# EAGLE design Main (EAGLE 9.0.1)
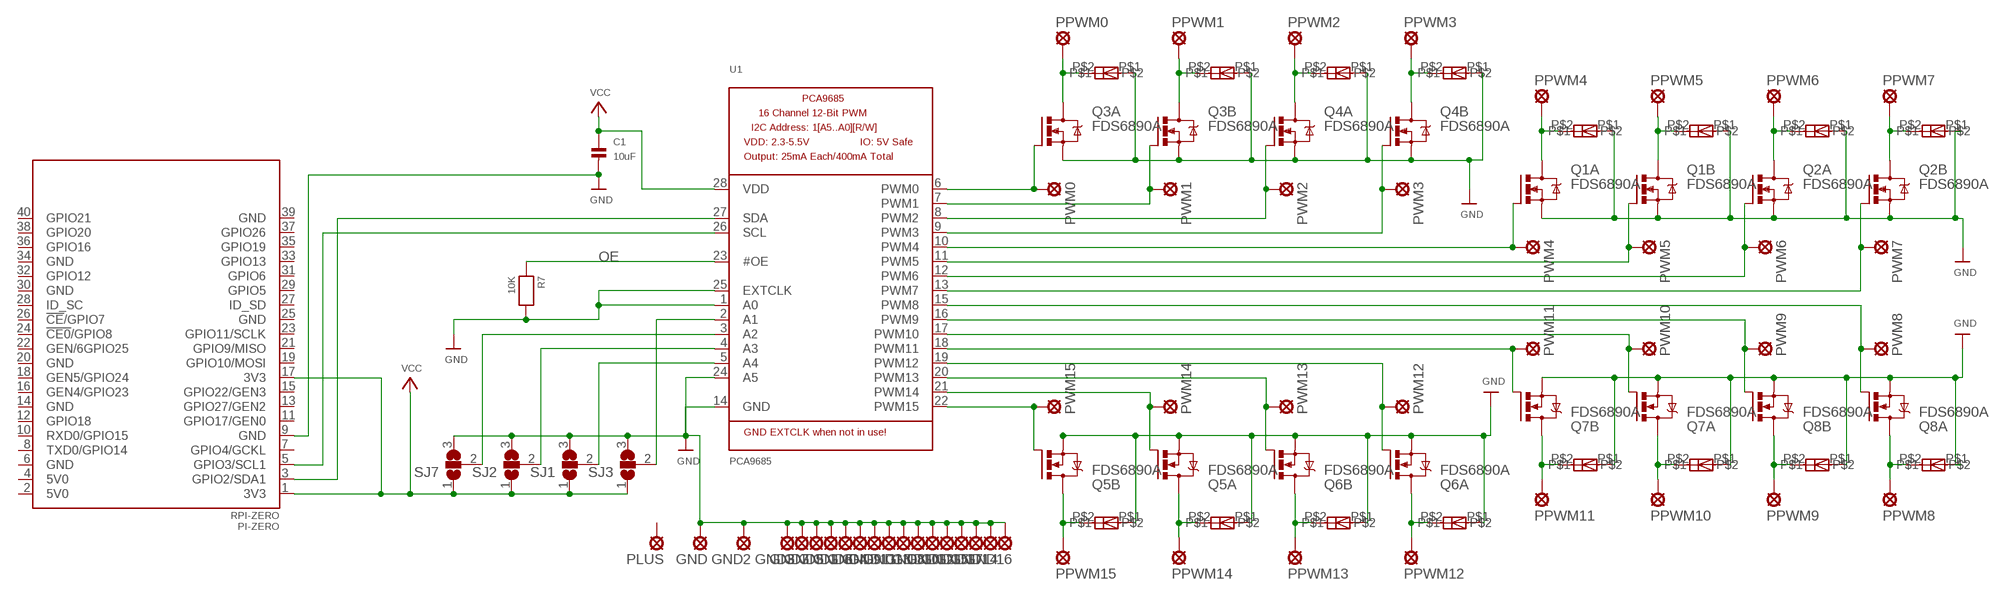
[diagram p0: schematic, sheet 1]

## Parts
C1  10uF  CAP_CERAMIC0805  [0805]
GND  LSP11  [LSP11]
GND1  LSP11  [LSP11]
GND2  LSP11  [LSP11]
GND3  LSP11  [LSP11]
GND4  LSP11  [LSP11]
GND5  LSP11  [LSP11]
GND6  LSP11  [LSP11]
GND7  LSP11  [LSP11]
GND8  LSP11  [LSP11]
GND9  LSP11  [LSP11]
GND10  LSP11  [LSP11]
GND11  LSP11  [LSP11]
GND12  LSP11  [LSP11]
GND13  LSP11  [LSP11]
GND14  LSP11  [LSP11]
GND15  LSP11  [LSP11]
GND16  LSP11  [LSP11]
GND17  LSP11  [LSP11]
PI-ZERO  RPI-ZERO  [RASPBERRYPI_BASTELSTUBE_V13_RASPI_BOARD_B+_FULL]
PLUS  LSP11  [LSP11]
PPWM0  LSP11  [LSP11]
PPWM1  LSP11  [LSP11]
PPWM2  LSP11  [LSP11]
PPWM3  LSP11  [LSP11]
PPWM4  LSP11  [LSP11]
PPWM5  LSP11  [LSP11]
PPWM6  LSP11  [LSP11]
PPWM7  LSP11  [LSP11]
PPWM8  LSP11  [LSP11]
PPWM9  LSP11  [LSP11]
PPWM10  LSP11  [LSP11]
PPWM11  LSP11  [LSP11]
PPWM12  LSP11  [LSP11]
PPWM13  LSP11  [LSP11]
PPWM14  LSP11  [LSP11]
PPWM15  LSP11  [LSP11]
PWM0  LSP11  [LSP11]
PWM1  LSP11  [LSP11]
PWM2  LSP11  [LSP11]
PWM3  LSP11  [LSP11]
PWM4  LSP11  [LSP11]
PWM5  LSP11  [LSP11]
PWM6  LSP11  [LSP11]
PWM7  LSP11  [LSP11]
PWM8  LSP11  [LSP11]
PWM9  LSP11  [LSP11]
PWM10  LSP11  [LSP11]
PWM11  LSP11  [LSP11]
PWM12  LSP11  [LSP11]
PWM13  LSP11  [LSP11]
PWM14  LSP11  [LSP11]
PWM15  LSP11  [LSP11]
Q1  FDS6890A  [M08A]
Q2  FDS6890A  [M08A]
Q3  FDS6890A  [M08A]
Q4  FDS6890A  [M08A]
Q5  FDS6890A  [M08A]
Q6  FDS6890A  [M08A]
Q7  FDS6890A  [M08A]
Q8  FDS6890A  [M08A]
R7  10K  RESISTOR0805  [0805]
SJ1  SJ2W  [SJ_2]
SJ2  SJ2W  [SJ_2]
SJ3  SJ2W  [SJ_2]
SJ7  SJ2W  [SJ_2]
U1  PCA9685  MICROBUILDER_PCA9685  [MICROBUILDER_TSSOP28]
U$6  OPTIONALDIODE  [OPTIONALDIODE]
U$7  OPTIONALDIODE  [OPTIONALDIODE]
U$8  OPTIONALDIODE  [OPTIONALDIODE]
U$9  OPTIONALDIODE  [OPTIONALDIODE]
U$10  OPTIONALDIODE  [OPTIONALDIODE]
U$11  OPTIONALDIODE  [OPTIONALDIODE]
U$12  OPTIONALDIODE  [OPTIONALDIODE]
U$13  OPTIONALDIODE  [OPTIONALDIODE]
U$14  OPTIONALDIODE  [OPTIONALDIODE]
U$15  OPTIONALDIODE  [OPTIONALDIODE]
U$16  OPTIONALDIODE  [OPTIONALDIODE]
U$17  OPTIONALDIODE  [OPTIONALDIODE]
U$18  OPTIONALDIODE  [OPTIONALDIODE]
U$19  OPTIONALDIODE  [OPTIONALDIODE]
U$20  OPTIONALDIODE  [OPTIONALDIODE]
U$21  OPTIONALDIODE  [OPTIONALDIODE]

## Nets
GND: C1.2 GND1.MP GND2.MP GND3.MP GND4.MP GND5.MP GND6.MP GND7.MP GND8.MP GND9.MP GND10.MP GND11.MP GND12.MP GND13.MP GND14.MP GND15.MP GND16.MP GND17.MP GND.MP PI-ZERO.9(GND) Q1.1(A:S) Q1.3(B:S) Q2.1(A:S) Q2.3(B:S) Q3.1(A:S) Q3.3(B:S) Q4.1(A:S) Q4.3(B:S) Q5.1(A:S) Q5.3(B:S) Q6.1(A:S) Q6.3(B:S) Q7.1(A:S) Q7.3(B:S) Q8.1(A:S) Q8.3(B:S) R7.2 SJ1.3 SJ2.3 SJ3.3 SJ7.3 U1.1(A0) U1.14(GND) U1.24(A5) U1.25(EXTCLK) U$6.P$1 U$7.P$1 U$8.P$1 U$9.P$1 U$10.P$1 U$11.P$1 U$12.P$1 U$13.P$1 U$14.P$1 U$15.P$1 U$16.P$1 U$17.P$1 U$18.P$1 U$19.P$1 U$20.P$1 U$21.P$1
LPWM0: PWM0.MP Q3.2(A:G) U1.6(PWM0)
LPWM1: PWM1.MP Q3.4(B:G) U1.7(PWM1)
LPWM2: PWM2.MP Q4.2(A:G) U1.8(PWM2)
LPWM3: PWM3.MP Q4.4(B:G) U1.9(PWM3)
LPWM4: PWM4.MP Q1.2(A:G) U1.10(PWM4)
LPWM5: PWM5.MP Q1.4(B:G) U1.11(PWM5)
LPWM6: PWM6.MP Q2.2(A:G) U1.12(PWM6)
LPWM7: PWM7.MP Q2.4(B:G) U1.13(PWM7)
LPWM8: PWM8.MP Q8.2(A:G) U1.15(PWM8)
LPWM9: PWM9.MP Q8.4(B:G) U1.16(PWM9)
LPWM10: PWM10.MP Q7.2(A:G) U1.17(PWM10)
LPWM11: PWM11.MP Q7.4(B:G) U1.18(PWM11)
LPWM12: PWM12.MP Q6.2(A:G) U1.19(PWM12)
LPWM13: PWM13.MP Q6.4(B:G) U1.20(PWM13)
LPWM14: PWM14.MP Q5.2(A:G) U1.21(PWM14)
LPWM15: PWM15.MP Q5.4(B:G) U1.22(PWM15)
N$1: PPWM0.MP Q3.7(A:D) Q3.8(A:D) U$7.P$2
N$2: PPWM1.MP Q3.5(B:D) Q3.6(B:D) U$8.P$2
N$3: PPWM2.MP Q4.7(A:D) Q4.8(A:D) U$9.P$2
N$4: PPWM3.MP Q4.5(B:D) Q4.6(B:D) U$10.P$2
N$6: PPWM4.MP Q1.7(A:D) Q1.8(A:D) U$11.P$2
N$7: PPWM5.MP Q1.5(B:D) Q1.6(B:D) U$12.P$2
N$8: PPWM6.MP Q2.7(A:D) Q2.8(A:D) U$13.P$2
N$9: PPWM7.MP Q2.5(B:D) Q2.6(B:D) U$14.P$2
N$11: PPWM15.MP Q5.5(B:D) Q5.6(B:D) U$6.P$2
N$12: PPWM14.MP Q5.7(A:D) Q5.8(A:D) U$21.P$2
N$13: PPWM13.MP Q6.5(B:D) Q6.6(B:D) U$20.P$2
N$14: PPWM12.MP Q6.7(A:D) Q6.8(A:D) U$19.P$2
N$16: PPWM11.MP Q7.5(B:D) Q7.6(B:D) U$18.P$2
N$17: PPWM10.MP Q7.7(A:D) Q7.8(A:D) U$17.P$2
N$18: PPWM9.MP Q8.5(B:D) Q8.6(B:D) U$16.P$2
N$19: PPWM8.MP Q8.7(A:D) Q8.8(A:D) U$15.P$2
N$21: PI-ZERO.5(GPIO3/SCL1) U1.26(SCL)
N$22: SJ7.2 U1.3(A2)
N$23: SJ2.2 U1.4(A3)
N$24: SJ1.2 U1.5(A4)
N$26: PI-ZERO.3(GPIO2/SDA1) U1.27(SDA)
N$27: SJ3.2 U1.2(A1)
OE: R7.1 U1.23(#OE)
VCC: C1.1 PI-ZERO.1(3V3) PI-ZERO.17(3V3) SJ1.1 SJ2.1 SJ3.1 SJ7.1 U1.28(VDD)
Unconnected: PI-ZERO.2(5V0) PI-ZERO.4(5V0) PI-ZERO.6(GND) PI-ZERO.7(GPIO4/GCKL) PI-ZERO.8(TXD0/GPIO14) PI-ZERO.10(RXD0/GPIO15) PI-ZERO.11(GPIO17/GEN0) PI-ZERO.12(GPIO18) PI-ZERO.13(GPIO27/GEN2) PI-ZERO.14(GND) PI-ZERO.15(GPIO22/GEN3) PI-ZERO.16(GEN4/GPIO23) PI-ZERO.18(GEN5/GPIO24) PI-ZERO.19(GPIO10/MOSI) PI-ZERO.20(GND) PI-ZERO.21(GPIO9/MISO) PI-ZERO.22(GEN/6GPIO25) PI-ZERO.23(GPIO11/SCLK) PI-ZERO.24(!CE0!/GPIO8) PI-ZERO.25(GND) PI-ZERO.26(!CE!/GPIO7) PI-ZERO.27(ID_SD) PI-ZERO.28(ID_SC) PI-ZERO.29(GPIO5) PI-ZERO.30(GND) PI-ZERO.31(GPIO6) PI-ZERO.32(GPIO12) PI-ZERO.33(GPIO13) PI-ZERO.34(GND) PI-ZERO.35(GPIO19) PI-ZERO.36(GPIO16) PI-ZERO.37(GPIO26) PI-ZERO.38(GPIO20) PI-ZERO.39(GND) PI-ZERO.40(GPIO21) PLUS.MP

## Library data of the parts
C1 = microbuilder:CAP_CERAMIC: Ceramic Capacitors 0402 - 0402 Surface Mount Capacitors 16pF 50V 5% [Digikey: 445-4899-2-ND] 18pF 50V 5% [Digikey: 490-1281-2-ND] 22pF 50V 5% [Digikey: 490-1283-2-ND] 68pF 50V 5% [Digikey: 490-1289-2-ND] 0.1uF 10V 10% [Digikey: 490-1318-2-ND] 1.0uF 6.3V 10% [Digikey: 490-1320-2-ND] 0603 - 0603 Surface Mount Capacitors 16 pF 50V 5% [Digikey: 445-5051-2-ND] 22 pF 50V [Digikey: PCC220ACVTR-ND] 33 pF 50V 5% [Digikey: 490-1415-1-ND] 56pF 50V 5% [Digikey: 490-1421-1-ND] 220pF 50V 5% [Digikey: 445-1285-1-ND] 680 pF 50V 2200 pF 50V 5% C0G [Digikey: 445-1297-1-ND] 5600 pF 100V 5% X7R [Digikey: 478-3711-1-ND] 0.1 µF 25V 10% [Digikey: PCC2277TR-ND] 0.22 µF 16V 10% X7R [Digikey: 445-1318-1-ND] 1.0 µF 25V 10% [Digikey: 445-5146-2-ND] 0603 - RF Specific 3pF 250V +/-0.1pF RF [Digikey: 712-1347-1-ND] 18 pF 250V 5% [Digikey: 478-3505-1-ND or 712-1322-1-ND] 56 pF 250V 5% C0G RF [Digikey: 490-4867-1-ND] 68 pF 250V RF [Digikey: 490-4868-1-ND] 0805 - 0805 Surface Mount Capacitors 220 pF 250V 2% RF Ceramic Capacitor [Digikey: 712-1398-1-ND] 1000 pF 50V 2% NP0 Ceramic Capacitor [Digikey: 478-3760-1-ND] 0.1 µF 25V 10% Ceramic Capacitor [Digikey: PCC1828TR-ND] 1.0 µF 16V 10% Ceramic Capacitor[Digikey: 490-1691-2-ND] 10.0 µF 10V 10% Ceramic Capacitor[Digikey: 709-1228-1-ND] 10.0 uF 16V 10% Ceramic Capacitor [Digikey: 478-5165-2-ND] 47 uF 6.3V 20% Ceramic Capacitor [Digikey: 587-1779-1-ND or 399-5506-1-ND] 1206 - 1206 Surface Mount Capacitors 47uF 10V 20% Ceramic Capacitor [Digikey: 490-5528-1-ND or 399-5508-1-ND or 445-6010-1-ND] 100uF 6.3V -20%, +80% Y5V Ceramic Capacitor (Digikey: 490-4512-1-ND, Mouser: 81-GRM31CF50J107ZE1L)
GND GND1-GND17 PLUS PPWM0 PPWM1-PPWM15 PWM0 PWM1-PWM15 = solpad:LSP11: SOLDER PAD drill 1.1 mm
PI-ZERO = RPI-Zero:RPI-ZERO
Q1-Q8 = transistor-power:FDS6890A: Dual N-Channel 2.5V Specified PowerTrenchTM MOSFET Source: FDS6890A.pdf
R7 = microbuilder:RESISTOR: Resistors 0402 - 0402 Surface Mount Package 22 Ohm 1% 1/16W [Digikey: 311-22.0LRTR-ND] 33 Ohm 5% 1/16W 1.0K 5% 1/16W 1.5K 5% 1/16W 2.0K 1% 1/16W 10.0K 1% 1/16W [Digikey: 311-10.0KLRTR-ND] 10.0K 5% 1/16W [Digikey: RMCF0402JT10K0TR-ND] 12.1K 1% 1/16W [Digikey: 311-22.0LRTR-ND] 100.0K 5% 1/16W 0603 - 0603 Surface Mount Package 0 Ohm 1/10 Watt 1% Resistor 15 Ohm 1/10 Watt 1% Resistor 33 Ohm 1/10 Watt 1% Resistor 49.9 Ohm 1/10 Watt 1% Resistor 100 Ohm 1/10 Watt 1% Resistor 150 Ohm 1/10 Watt 1% Resistor 240 Ohm 1/10 Watt 1% Resistor 390 Ohm 1/10 Watt 1% Resistor 560 Ohm 1/10 Watt 1% Resistor 680 Ohm 1/10 Watt 1% Resistor 750 Ohm 1/10 Watt 1% Resistor 1.0K Ohm 1/10 Watt 1% Resistor 1.5K Ohm 1/10 Watt 1% Resistor 2.0K Ohm 1/10 Watt 1% Resistor 2.2K Ohm 1/10 Watt 1% Resistor 3.3K Ohm 1/10 Watt 1% Resistor 4.7K Ohm 1/10 Watt 1% Resistor 10.0K Ohm 1/10 Watt 1% Resistor 12.0K Ohm 1/10 Watt 1% Resistor 12.1K Ohm 1/10 Watt 1% Resistor 20.0K Ohm 1/10 Watt 1% Resistor 33.0K Ohm 1/10 Watt 1% Resistor 100.0K Ohm 1/10 Watt 1% Resistor 0805 - 0805 Surface Mount Package 0 Ohm 1/8 Watt 1% Resistor 33 Ohm 1/8 Watt 1% Resistor 100 Ohm 1/8 Watt 1% Resistor 150 Ohm 1/8 Watt 1% Resistor 200 Ohm 1/8 Watt 1% Resistor 240 Ohm 1/8 Watt 1% Resistor 330 Ohm 1/8 Watt 1% Resistor 390 Ohm 1/8 Watt 1% Resistor 470 Ohm 1/8 Watt 1% Resistor 1.0K Ohm 1/8 Watt 1% Resistor 1.5K Ohm 1/8 Watt 1% Resistor 2.0K Ohm 1/8 Watt 1% Resistor 4.7K Ohm 1/8 Watt 1% Resistor 5.1K Ohm 1/8 Watt 1% Resistor 5.6K Ohm 1/8 Watt 1% Resistor 10.0K Ohm 1/8 Watt 1% Resistor 22.0K Ohm 1/8 Watt 1% Resistor 33.0K Ohm 1/8 Watt 1% Resistor 100K Ohm 1/8 Watt 1% Resistor 1206 - 1206 Surface Mount Package 2012 - 2010 Surface Mount Package 0.11 Ohm 1/2 Watt 1% Resistor - Digikey: RHM.11UCT-ND
SJ1-SJ3 SJ7 = jumper:SJ2W: SMD solder JUMPER
U1 = Main:MICROBUILDER_PCA9685: PCA9685 - 16 Channel 12-Bit I2C PWM Controller 5.0V tolerant 16 channel, 12-bit I2C PWM controller with 25mA per output (max. 400mA total) Digikey: 568-5931-1-ND
U$6-U$21 = RaspiPowerPWM:OPTIONALDIODE

## Board
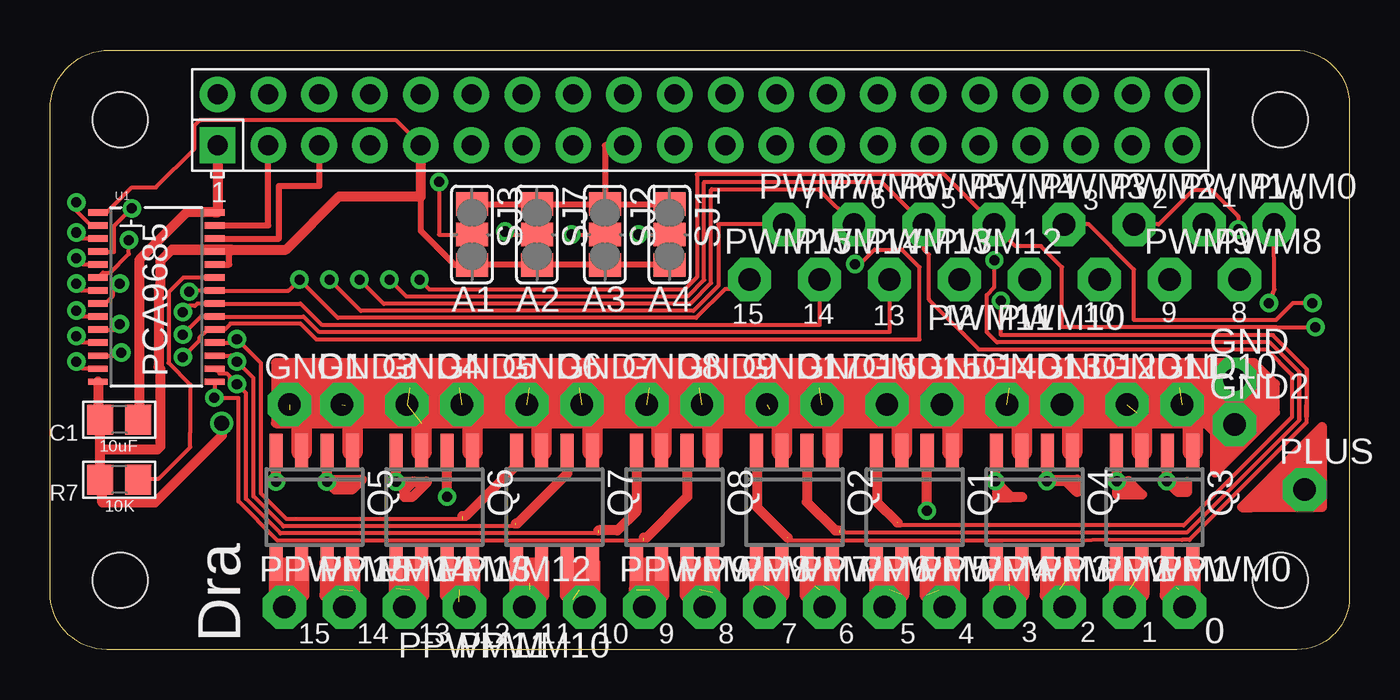
[diagram p1: board, top side]
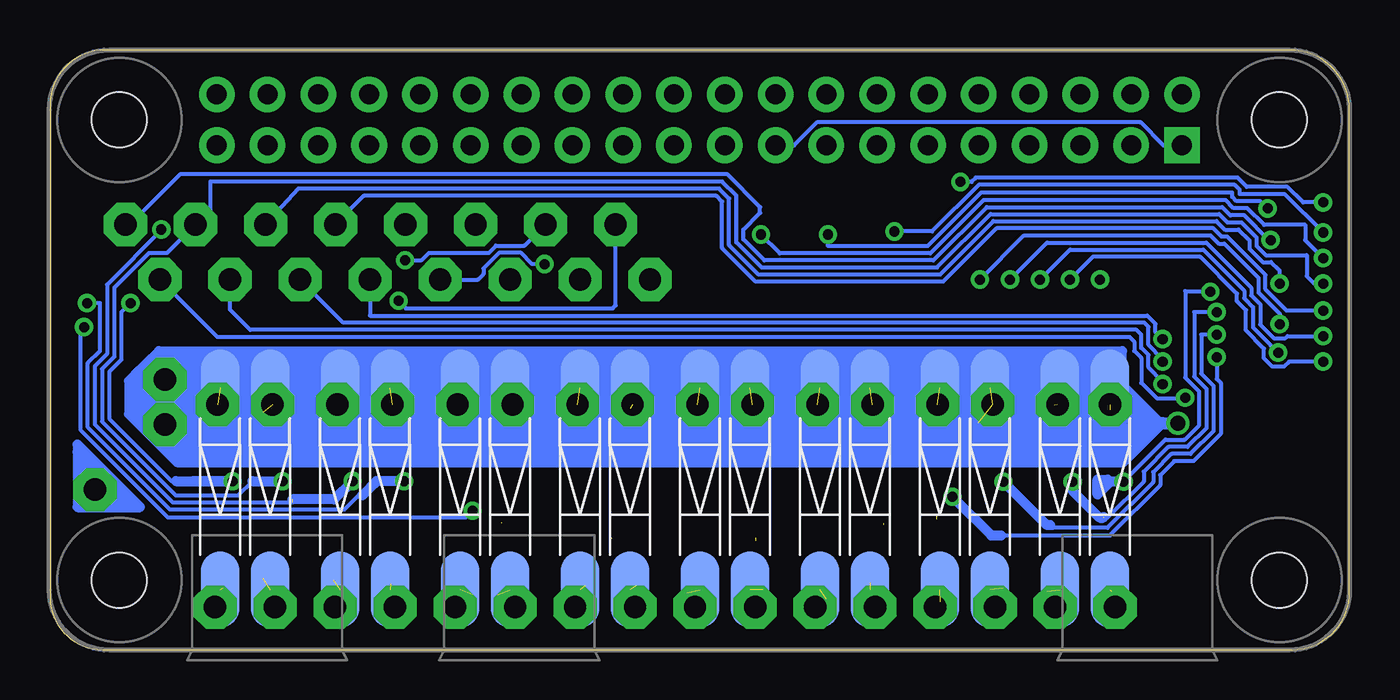
[diagram p2: board, bottom side, seen from below]

Size 64.97 x 29.97 mm. Coordinates in mm from the lower left corner, seen from the top.
Outline: 2.97,29.97 62.22,29.97 arc-90 64.97,27.25 64.97,2.62 arc-90 62.34,0 2.85,0 arc-90 0,2.88 0,27 arc-90 2.97,29.97
Copper layers (1*16): Top 0.035mm / dielectric 1.5mm / Bottom 0.035mm
Design rules "default *": minimum track width 0.2mm, minimum drill 0.5mm, track to track 6mil, track to pad 6mil, pad to pad 6mil, via to via 6mil, smd to smd 6mil, copper to edge 30mil, drill to drill 6mil, minimum pad ring 10mil, minimum via ring 8mil, stop-mask expansion 4mil, vias tented up to drill 0mil, thermal gap 10mil

### Footprints (pad centres in the part's own frame; a part is rotated, then mirrored left to right if it is on the bottom)
0805 = smd 1.3 x 1.5: 1 -0.95,0; 2 0.95,0
LSP11 = drill 1.118 pad 2.159 octagon: MP 0,0
RASPBERRYPI_BASTELSTUBE_V13_RASPI_BOARD_B+_FULL = drill 1 pad 1.778 square: 1 8.37,25.23 | drill 1 pad 1.778: 2 8.37,27.77; 3 10.91,25.23; 4 10.91,27.77; 5 13.45,25.23; 6 13.45,27.77; 7 15.99,25.23; 8 15.99,27.77; 9 18.53,25.23; 10 18.53,27.77; 11 21.07,25.23; 12 21.07,27.77; 13 23.61,25.23; 14 23.61,27.77; 15 26.15,25.23; 16 26.15,27.77; 17 28.69,25.23; 18 28.69,27.77; 19 31.23,25.23; 20 31.23,27.77; 21 33.77,25.23; 22 33.77,27.77; 23 36.31,25.23; 24 36.31,27.77; 25 38.85,25.23; 26 38.85,27.77; 27 41.39,25.23; 28 41.39,27.77; 29 43.93,25.23; 30 43.93,27.77; 31 46.47,25.23; 32 46.47,27.77; 33 49.01,25.23; 34 49.01,27.77; 35 51.55,25.23; 36 51.55,27.77; 37 54.09,25.23; 38 54.09,27.77; 39 56.63,25.23; 40 56.63,27.77 | hole 2.75: 3.5,3.5; 3.5,26.5; 61.5,3.5; 61.5,26.5
M08A = smd 0.65 x 1.75: 1 -1.905,-2.8; 2 -0.635,-2.8; 3 0.635,-2.8; 4 1.905,-2.8; 5 1.905,2.8; 6 0.635,2.8; 7 -0.635,2.8; 8 -1.905,2.8
SJ_2 = smd 1.168 x 1.6: 1 -1.524,0; 2 0,0; 3 1.524,0
MICROBUILDER_TSSOP28 = smd 0.305 x 0.991: 1 -4.225,-2.918; 2 -3.575,-2.918; 3 -2.925,-2.918; 4 -2.275,-2.918; 5 -1.625,-2.918; 6 -0.975,-2.918; 7 -0.325,-2.918; 8 0.325,-2.918; 9 0.975,-2.918; 10 1.625,-2.918; 11 2.275,-2.918; 12 2.925,-2.918; 13 3.575,-2.918; 14 4.225,-2.918; 15 4.225,2.918; 16 3.575,2.918; 17 2.925,2.918; 18 2.275,2.918; 19 1.625,2.918; 20 0.975,2.918; 21 0.325,2.918; 22 -0.325,2.918; 23 -0.975,2.918; 24 -1.625,2.918; 25 -2.275,2.918; 26 -2.925,2.918; 27 -3.575,2.918; 28 -4.225,2.918
OPTIONALDIODE = smd 1.93 x 3.81: P$1 0,1.349; P$2 0,-8.75

### Placement (x,y rotation side)
C1  3.47,11.5 180 top
GND  59.22,13.5 0 top
GND1  11.97,12.25 0 top
GND2  59.22,11.25 0 top
GND3  14.6,12.25 0 top
GND4  17.84,12.25 0 top
GND5  20.59,12.25 0 top
GND6  23.84,12.25 0 top
GND7  26.59,12.25 0 top
GND8  29.84,12.25 0 top
GND9  32.59,12.25 0 top
GND10  56.59,12.25 0 top
GND11  53.84,12.25 0 top
GND12  50.59,12.25 0 top
GND13  47.84,12.25 0 top
GND14  44.59,12.25 0 top
GND15  41.84,12.25 0 top
GND16  38.59,12.25 0 top
GND17  35.84,12.25 0 top
PI-ZERO  0.01,-0.02 0 top
PLUS  62.72,8 0 top
PPWM0  56.72,2.12 0 top
PPWM1  53.72,2.12 0 top
PPWM2  50.72,2.12 0 top
PPWM3  47.72,2.12 0 top
PPWM4  44.72,2.12 0 top
PPWM5  41.72,2.12 0 top
PPWM6  38.72,2.12 0 top
PPWM7  35.72,2.12 0 top
PPWM8  32.72,2.12 0 top
PPWM9  29.72,2.12 0 top
PPWM10  26.72,2.12 180 top
PPWM11  23.72,2.12 180 top
PPWM12  20.72,2.12 0 top
PPWM13  17.72,2.12 0 top
PPWM14  14.72,2.12 0 top
PPWM15  11.72,2.12 0 top
PWM0  61.19,21.25 0 top
PWM1  57.69,21.25 0 top
PWM2  54.19,21.25 0 top
PWM3  50.7,21.25 0 top
PWM4  47.2,21.25 0 top
PWM5  43.7,21.25 0 top
PWM6  40.2,21.25 0 top
PWM7  36.7,21.25 0 top
PWM8  59.47,18.5 0 top
PWM9  55.97,18.5 0 top
PWM10  52.47,18.5 180 top
PWM11  48.97,18.5 180 top
PWM12  45.47,18.5 0 top
PWM13  41.97,18.5 0 top
PWM14  38.47,18.5 0 top
PWM15  34.97,18.5 0 top
Q1  43.22,7.12 180 top
Q2  37.22,7.12 180 top
Q3  55.22,7.12 180 top
Q4  49.22,7.12 180 top
Q5  13.22,7.12 180 top
Q6  19.22,7.12 180 top
Q7  25.22,7.12 180 top
Q8  31.22,7.12 180 top
R7  3.47,8.5 180 top
SJ1  30.97,20.75 270 top
SJ2  27.74,20.75 270 top
SJ3  21.09,20.75 270 top
SJ7  24.34,20.75 270 top
U1  5.32,17.62 270 top
U$6  11.97,11.75 0 bottom
U$7  56.47,11.75 0 bottom
U$8  53.97,11.75 0 bottom
U$9  50.47,11.75 0 bottom
U$10  47.97,11.75 0 bottom
U$11  44.47,11.75 0 bottom
U$12  41.97,11.75 0 bottom
U$13  38.47,11.75 0 bottom
U$14  35.97,11.75 0 bottom
U$15  32.47,11.75 0 bottom
U$16  29.97,11.75 0 bottom
U$17  26.47,11.75 0 bottom
U$18  23.97,11.75 0 bottom
U$19  20.47,11.75 0 bottom
U$20  17.97,11.75 0 bottom
U$21  14.47,11.75 0 bottom

### Tracks (layer width: path | path; a pad name or v marks a point on that pad's centre or on a via)
GND  (via drill 0.75)  (14 unrouted)
  Top 0.203: U1.1 2.85,21.85 4.1,23.1 5.29,23.1 7.23,25.04 7.23,26.2 7.5,26.47 17.27,26.47 PI-ZERO.9
  Top 0.305: 18.54,22.65 18.54,20.92 20.23,19.23 SJ3.3 SJ7.3 SJ2.3 SJ1.3 | U1.24 8.97,19.25 8.97,19.9 U1.25 5.85,19.9 5.52,19.42 | 2.18,12.05 2.44,11.63 C1.2 2.52,11.25 2.52,10 R7.2 2.51,7.5 2.51,7.44 5.22,7.44
  Top 0.508: PI-ZERO.9 18.54,22.65 14.46,22.65 11.8,19.99 9.06,19.99 | 8.97,19.9 9.06,19.99 | 9.06,19.99 6.09,19.99 5.52,19.42 5.52,18.17 5.42,18.07 5.42,14.13 5.52,14.03 5.52,10.15 5.37,10 2.52,10 | v8.59,11.33 8.59,10.69 5.24,7.34 2.61,7.34 2.61,8.41 R7.2 2.52,11.25 | U1.14 2.4,11.67 2.44,11.63 | GND.MP 58.39,14.33 | 58.39,14.33 11.29,14.33 11.29,11.33 12.57,11.33 15.12,11.33 18.57,11.33 21.05,11.33 24.49,11.33 27.12,11.33 30.57,11.33 33.2,11.33 36.57,11.33 39.2,11.33 42.57,11.33 45.12,11.33 48.57,11.33 51.2,11.33 54.64,11.33 57.19,11.33 57.8,11.33 58.09,11.03 | Q6.3 18.57,9.94 | 58.09,11.03 58.25,10.88 | 58.25,10.88 58.25,10.12 | 58.25,10.12 58.25,9.75 | 58.25,9.75 58.25,9.38 | 58.25,9.38 58.25,8.85 59.33,9.94 | 59.33,9.94 61.25,11.85 61.25,13.28 60.19,14.33 58.39,14.33 | 58.25,9.38 59.29,9.92 | 59.29,9.92 59.33,9.94 | 58.25,9.75 58.63,9.81 | 58.63,9.81 59.29,9.92 | 58.92,10.72 58.53,10.38 | 58.53,10.38 58.25,10.12 | 58.63,9.81 58.53,10.38 | 57.87,12.37 58.09,11.03 | 58.25,10.88 GND2.MP 58.55,11.55 | GND14.MP 44.59,12.31 | 44.59,12.31
  Top 1.016: Q5.3 12.58,11.31 12.57,11.33 | Q5.1 15.13,11.32 15.12,11.33 | Q6.3 18.59,11.31 18.57,11.33 | Q6.1 21.12,11.25 21.05,11.33 | Q7.3 24.59,11.23 24.49,11.33 | Q7.1 27.12,11.32 27.12,11.33 | Q8.1 33.12,11.25 33.2,11.33 | Q8.3 30.59,11.31 30.57,11.33 | Q2.3 36.59,11.31 36.57,11.33 | Q2.1 39.12,11.25 39.2,11.33 | Q1.3 42.59,11.31 42.57,11.33 | Q1.1 45.12,11.32 45.12,11.33 | Q4.3 48.59,11.31 48.57,11.33 | Q4.1 51.12,11.25 51.2,11.33 | Q3.3 54.58,11.27 54.64,11.33 | Q3.1 57.12,11.25 57.19,11.33
  Top 1.27: GND.MP 11.9,13.65 11.97,12 12.79,12.67 60.05,13.5 60.72,12.9 60.34,11.78 58.92,10.72 59.97,12.97 58.02,12.38 57.87,12.37 44.59,12.31 12.95,12.15 58.32,12
  Bottom 0.203: U$12.P$1 41.84,12.97 GND15.MP
  Bottom 0.508: 11.37,9.38 11.37,13.25 | 11.37,13.25 11.37,14.92 59.52,14.92 60.21,14.24 | 60.21,14.24 60.46,13.99 | 60.46,13.99 61.02,13.42 61.02,11.78 60.3,11.05 | 60.3,11.05 58.62,9.38 11.37,9.38 | 11.37,13.25 9.45,11.33 9.35,11.33 11.29,9.38 11.37,9.38 | 60.21,14.24 59.47,13.5 GND.MP 59.97,13.5 60.46,13.99 | GND2.MP 60.09,11.25 60.3,11.05
  Bottom 0.61: U$21.P$1 13.6,12.22 11.15,12.22 10.24,11.33 10.02,11.33 9.35,11.33 v8.59,11.33
  Bottom 1.27: U$21.P$1 U$6.P$1 | U$17.P$1 U$18.P$1 25.09,14.22 25.09,14.25 | U$13.P$1 U$14.P$1 35.97,12.05 36.84,11.17 | U$10.P$1 U$9.P$1 | GND.MP 59.22,14.4 59.07,14.25 48.84,14.25 | 48.84,14.25 34.09,14.25 | 34.09,14.25 31.09,14.25 | 31.09,14.25 25.09,14.25 | 25.09,14.25 19.34,14.25 | 19.34,14.25 12.12,14.25 12.12,12 | 12.12,12 12.12,10.12 12.04,10.05 | 12.04,10.05 11.97,9.97 11.55,9.97 10.2,11.33 | 12.04,10.05 12.65,10.05 | 12.65,10.05 58.47,10.05 59.22,10.8 GND2.MP 59.97,12 60.27,12 60.34,12.08 60.34,13.2 59.52,13.2 GND.MP | GND.MP 58.82,13.1 U$7.P$1 U$8.P$1 U$13.P$1 | U$13.P$1 U$17.P$1 | U$17.P$1 U$19.P$1 | U$19.P$1 U$21.P$1 | U$6.P$1 12.95,12.12 12.95,10.88 12.65,10.58 12.65,10.05 | 12.65,10.05 13.47,10.88 13.47,11.17 36.84,11.17 | 36.84,11.17 43.59,11.17 | 43.59,11.17 58.69,11.17 59.3,11.78 59.3,12.45 58.47,12.45 57.8,11.78 57.57,12 57.57,12.22 54.72,12.22 54.34,11.85 51.34,11.85 51.05,12.15 27.57,12.15 27.49,12.22 14.74,12.22 14.6,12.08 | U$6.P$1 10.2,11.33 | 10.2,11.33 10.02,11.33 | U$21.P$1 15.12,13.75 15.85,13.75 14.1,12 12.12,12 | U$19.P$1 19.34,14.22 19.34,14.25 | 31.09,14.25 30.59,13.75 30.59,13.72 U$16.P$1 U$15.P$1 32.94,13.1 34.09,14.25 | 40.34,10.5 41.97,12.12 U$12.P$1 U$11.P$1 44.47,12.05 43.59,11.17 | U$10.P$1 48.84,13.97 48.84,14.25 | U$10.P$1 49.75,13.1 GND12.MP
LPWM0  (via drill 0.5)
  Top 0.203: v60.94,17.33 61.22,18 PWM0.MP | U1.6 2.65,18.84 3,18.84 3.95,19.79 v3.95,20.47
  Top 0.508: v55.84,8.42 Q3.2 | v55.84,8.42 55.89,8.38 56.84,8.38 56.84,7.88 56.39,7.88 v55.84,8.42
  Bottom 0.203: v60.94,17.33 61.4,16.87 61.4,14.49 62.01,13.89 62.01,11.55 58.88,8.42 58.67,8.42 | PWM0.MP 60.97,21.25 58.47,23.75 31.09,23.75 29.47,22.12 29.47,21.83 30.3,20.99 30.3,20.51 29.25,19.46 20.81,19.46 18.14,22.12 6.36,22.12 5.95,21.71 5.26,21.71 4.02,20.47 v3.95,20.47
  Bottom 0.508: 57.79,8.42 v55.84,8.42 58.67,8.42
LPWM1  (via drill 0.5)
  Top 0.203: U1.7 1.5,17.95 v1.32,18.3
  Top 0.508: v53.34,8.42 53.34,9.89 Q3.4 | 53.97,7.75 54.59,7.75 53.92,8.42 v53.34,8.42 | 53.97,7.75 53.34,7.75 v53.34,8.42 | v53.34,8.42 53.34,8.38 53.97,7.75
  Bottom 0.203: 54.85,8.42 55.55,7.72 58.68,7.72 62.36,11.4 62.36,14.03 61.75,14.64 61.75,18.1 60.02,19.83 59.11,19.83 PWM1.MP 56.95,21.99 56.95,23.39 31.36,23.39 30.66,22.69 30.66,20.36 29.4,19.1 20.62,19.1 17.95,21.77 6.51,21.77 6.1,21.36 5.41,21.36 4.65,20.6 4.65,20.18 4.2,19.72 2.15,19.72 2.15,18.67 1.77,18.3 v1.32,18.3
  Bottom 0.508: 54.85,8.42 v53.34,8.42
LPWM2  (via drill 0.5)  (1 unrouted)
  Top 0.203: v3.5,18.3 3.15,17.96 3.15,17.69 2.76,17.3 U1.8 | v59.4,21 59.4,21.65 58.09,22.96 57.14,22.96 55.43,21.25 PWM2.MP
  Top 0.508: v49.85,8.43 Q4.2 | v49.85,8.43 49.92,8.5 51.34,8.5 51.34,7.88 50.79,8.43 v49.85,8.43
  Bottom 0.203: PWM2.MP 52.56,23.04 31.51,23.04 31.01,22.54 31.01,20.21 29.55,18.75 20.47,18.75 17.8,21.41 6.66,21.41 6.24,21 5.55,21 5.01,20.45 5.01,20.03 4.34,19.37 3.92,19.37 3.5,18.94 v3.5,18.3 | 59.16,7.69 59.2,7.74 | 59.2,7.74 62.72,11.25 62.72,14.18 62.11,14.79 62.11,18.25 59.4,20.96 v59.4,21 | 59.2,7.74 | 59.2,7.74 58.83,7.36 52.84,7.36
  Bottom 0.508: v49.85,8.43 50.76,7.51 52.84,7.51
LPWM3  (via drill 0.5)
  Top 0.203: U1.9 1.54,16.65 v1.32,16.95 | v63.12,17.33 62.14,17.33 61.29,16.47 61.02,16.47 54.19,16.48 54.19,19 51.95,21.25 PWM3.MP
  Top 0.508: v47.27,8.42 47.27,9.88 Q4.4 | v47.27,8.42 47.34,8.35 47.34,7.62 48.07,7.62 | 48.59,7.62 48.07,7.62 | 48.07,7.62 v47.27,8.42
  Bottom 0.203: 1.61,16.92 v1.32,16.95 3.15,16.95 4.2,18.01 4.2,18.73 6.12,20.64 6.39,20.64 6.81,21.06 17.66,21.06 20.32,18.39 29.69,18.39 31.37,20.07 31.37,22.39 31.66,22.68 49.29,22.68 49.72,22.25 PWM3.MP | v63.12,17.33 62.47,17.33 62.47,14.94 63.07,14.33 63.07,11.11 58.97,7.01 50.27,7.01 49.47,7.8 49.37,7.7
  Bottom 0.508: v47.27,8.42 48.64,8.42 48.99,8.08 48.99,8.07 49.37,7.7
LPWM4  (via drill 0.5)
  Top 0.203: 43.85,9.83 Q1.2 | v63.27,16.12 63.26,16.11 61.34,16.11 50.59,16.12 50.59,19.12 49.55,20.17 48.27,20.17 PWM4.MP 44.7,23.75 32.34,23.75 32.34,18.62 31.72,18 18.97,18 v18.47,18.5 | U1.10 3.22,16 v3.5,16.28
  Top 0.508: v43.84,6.94 43.84,9.82 43.85,9.83
  Bottom 0.203: 63.28,10.81 63.22,10.75 | 63.22,10.75 | 63.28,10.81 63.43,10.96 63.43,15.82 v63.27,16.12 | 63.28,10.81 | v43.84,6.94 44.18,6.61 59.08,6.61 63.22,10.75 | v3.5,16.28 3.5,16.8 4.56,17.86 4.56,18.58 6.27,20.29 6.54,20.29 6.95,20.7 16.27,20.7 v18.47,18.5
LPWM5  (via drill 0.5)  (1 unrouted)
  Top 0.203: U1.11 1.6,15.35 v1.32,15.67 | 42.38,6.34 42.51,6.21 56.68,6.21 62.09,11.62 62.09,13.75 60.84,15 46.44,15 43.95,17.5 43.95,19.75 43.7,20 PWM5.MP 41.57,23.38 40.62,23.38 40.47,23.38 32.72,23.38 32.7,23.36 32.7,18.48 31.87,17.64 17.83,17.64 v16.97,18.5
  Top 0.508: Q1.4 41.34,9.89 41.34,7.38 42.36,6.36 42.38,6.36
  Bottom 0.203: v1.32,15.67 3.1,15.67 3.2,15.57 3.79,15.57 4.47,16.25 4.47,17.27 4.91,17.71 4.91,18.09 7.17,20.35 15.12,20.35 v16.97,18.5
LPWM6  (via drill 0.5)  (1 unrouted)
  Top 0.203: 62.45,13.9 62.46,13.89 62.46,11.55 | 62.45,13.9 60.99,15.36 47.34,15.36 46.84,15.87 46.84,17.72 47.21,18.1 v47.21,19.47 | U1.12 3.42,14.7 v3.57,14.85 | 39.49,5.86 56.83,5.86 62.45,11.48 62.45,13.9 | v15.47,18.5 16.68,17.29 32.02,17.29 33.06,18.33 33.06,22.98 33.09,23.02 38.43,23.02 PWM6.MP
  Top 0.508: Q2.2 37.84,7.38 39.26,5.96 39.49,5.96
  Bottom 0.203: v47.21,19.47 46.39,19.47 46.02,19.83 43.02,19.83 42.67,20.19 41.26,20.19 PWM6.MP | v3.57,14.85 3.93,15.21 3.94,15.21 4.83,16.1 4.83,17.12 5.27,17.56 5.27,17.94 7.32,19.99 13.98,19.99 v15.47,18.5
LPWM7  (via drill 0.5)  (1 unrouted)
  Top 0.203: U1.13 1.65,14.05 1.45,14.25 v1.32,14.4 | 56.89,5.5 56.59,5.49 | 56.59,5.49 47.59,5.45 37.02,5.45 36.89,5.58 | 62.82,14.03 62.83,14.03 62.83,12.25 | 62.82,14.03 61.14,15.72 47.55,15.72 v47.55,17.43 | 62.83,12.25 62.83,11.62 62.82,11.62 | PWM7.MP 33.41,21.25 33.41,18.18 32.16,16.93 15.54,16.93 v13.97,18.5 | 62.82,11.62 62.82,11.34 56.97,5.49 56.59,5.49 | 62.82,14.03 62.82,12.24 | 62.82,12.24 62.83,12.25 | 62.82,11.62 62.82,12.24
  Top 0.508: Q2.4 35.34,9.89 35.34,7.12 36.86,5.61 36.89,5.61
  Bottom 0.203: v1.32,14.4 3.02,14.4 3.28,14.14 3.86,14.14 4.28,14.56 4.28,15.05 5.18,15.95 5.18,16.97 5.62,17.42 5.62,17.79 7.47,19.63 12.85,19.63 12.85,19.62 v13.97,18.5 | v47.55,17.43 47.17,17.06 36.84,17.06 36.7,17.2 PWM7.MP
LPWM8  (via drill 0.5)  (1 unrouted)
  Top 0.203: 8.26,13.38 U1.15 8.24,12.62 v8.22,12.6 8.25,12.57 9.42,12.57 9.42,7.41 11.38,5.45 29.67,5.45
  Top 0.508: Q8.2 31.85,7.64 31.86,7.64 29.83,5.61 29.67,5.61
  Bottom 0.203: PWM8.MP 56.6,15.63 10.99,15.63 10.76,15.4 10.76,14.94 10.41,14.58 10.41,13.34 9.64,12.57 8.25,12.57 v8.22,12.6
LPWM9  (via drill 0.5)  (1 unrouted)
  Top 0.203: 8.6,14.05 U1.16 8.48,13.81 8.84,13.81 8.99,13.66 8.99,13.3 9.01,13.28 v9.35,13.28 9.79,12.83 9.79,7.54 11.53,5.81 27.42,5.81
  Top 0.508: Q8.4 29.31,6.91 28.37,5.96 27.42,5.96
  Bottom 0.203: PWM9.MP 55.97,17 54.96,15.99 10.65,15.99 10.41,15.75 10.41,15.08 10.05,14.73 10.05,14.11 9.35,13.4 v9.35,13.28
LPWM10  (via drill 0.5)  (1 unrouted)
  Top 0.203: 23.29,6.23 23.22,6.17 11.67,6.17 10.17,7.67 10.17,13.58 v9.35,14.4 9.04,14.7 U1.17
  Top 0.508: Q7.2 25.85,8.8 23.37,6.32 23.29,6.32
  Bottom 0.203: PWM10.MP 50.31,16.34 10.26,16.34 10.05,16.14 10.05,15.23 9.35,14.53 v9.35,14.4
LPWM11  (via drill 0.5)  (1 unrouted)
  Top 0.203: 20.62,6.52 11.82,6.52 10.54,7.8 10.54,14.33 v9.35,15.53 9.17,15.35 U1.18
  Top 0.508: Q7.4 23.31,9.22 20.77,6.67 20.62,6.67
  Bottom 0.203: v9.35,15.53 9.7,15.88 9.7,16.28 10.11,16.7 48.97,16.7 PWM11.MP
LPWM12  (via drill 0.5)
  Top 0.203: v6.65,14.62 7.49,15.47 7.49,15.61 7.88,16 U1.19 8.73,16 9.03,16.29 12.53,16.29 13.31,15.51 43.47,15.51 43.47,19.12 42.59,20 41.22,20 40.49,19.28 v40.24,19.28
  Top 0.508: v19.84,7.65 Q6.2
  Bottom 0.203: v6.65,14.62 6.65,13.53 6.45,13.33 6.45,10.78 7.8,9.43 8.76,9.43 9.46,8.72 9.46,8.23 11.97,5.72 17.43,5.72 | PWM12.MP 43.57,18.5 43.3,18.77 43.3,19.05 42.52,19.83 41.42,19.83 40.86,19.28 v40.24,19.28
  Bottom 0.508: v19.84,7.65 17.91,5.72 17.43,5.72
LPWM13  (via drill 0.5)
  Top 0.203: PWM13.MP 41.97,15.87 13.46,15.87 12.68,16.65 U1.20 7.54,16.65 v6.65,15.75
  Top 0.508: v17.3,8.4 17.31,8.4 Q6.4 | v17.3,8.4 18.15,8.4 | 17.72,7.97 17.72,7.62 18.09,7.62 18.84,8.38 18.82,8.4 18.22,8.4 18.15,8.4 | 17.72,7.97 v17.3,8.4 | 17.72,7.97 18.15,8.4
  Bottom 0.203: v6.65,15.75 7.41,15.75 7.41,13.8 6.8,13.19 6.8,10.93 7.95,9.78 8.91,9.78 9.82,8.87 9.82,8.38 12.1,6.09 14.84,6.09 14.97,6.22
  Bottom 0.508: 17.3,8.21 v17.3,8.4 15.12,6.22 14.97,6.22
LPWM14  (via drill 0.5)  (1 unrouted)
  Top 0.203: PWM14.MP 38.47,16.22 13.61,16.22 12.53,17.3 U1.21 7.37,17.3 7.26,17.19 6.96,17.19 v6.65,16.88
  Top 0.508: v13.85,8.4 v13.86,8.4 Q5.2 | v13.85,8.4 13.95,8.5 15.6,8.5 15.1,8 14.24,8 v13.85,8.4
  Bottom 0.203: v6.65,16.88 7.77,16.88 7.77,13.65 7.16,13.04 7.16,11.08 8.1,10.14 9.06,10.14 10.29,8.9 10.29,8.4 12.1,6.6 12.27,6.6
  Bottom 0.508: v13.85,8.4 13.85,7.95 12.49,6.6 12.31,6.6 12.29,6.62
LPWM15  (via drill 0.5)
  Top 0.203: v6.96,17.89 7.02,17.95 U1.22 11.92,17.95 v12.47,18.5 14.39,16.58 32.31,16.58 33.77,18.04 34.97,18.04 PWM15.MP
  Top 0.508: v11.29,8.4 11.31,8.4 Q5.4
  Bottom 0.203: v6.96,17.89 8.19,17.89 8.22,17.92 8.22,13.6 7.51,12.89 7.51,11.22 8.24,10.49 9.2,10.49 v11.29,8.4
  Bottom 0.508: v11.29,8.4 11.95,8.4 12.6,7.75 12.6,8.5 12.1,8.5
N$1  (1 unrouted)
  Top 0.61: Q3.7 Q3.8 | Q3.8 56.5,2.56 | 56.5,2.56 56.42,2.34 | Q3.7 57.12,3.6 | Q3.7 56.3,3.11 | 56.3,3.11 56.5,2.56 | Q3.8 56.3,3.11
  Top 0.75: Q3.7 55.86,2.74 56.42,2.34 PPWM0.MP 57.12,2.28 57.12,3.6 Q3.8
N$2  (1 unrouted)
  Top 0.61: Q3.6 Q3.5 54.35,3.58 | Q3.6 54.35,3.58 | 54.35,3.58 53.94,2.28 | Q3.6 53.31,2.78
  Top 0.75: Q3.5 53.31,2.78 53.31,2.28 PPWM1.MP 53.94,2.28 54.58,2.74 Q3.6
N$3  (1 unrouted)
  Top 0.61: Q4.8 Q4.7 50.82,3.5 | Q4.8 50.82,3.5 | 50.82,3.5 50.41,2.35 | Q4.8 49.85,2.74
  Top 0.75: Q4.7 49.85,2.74 50.41,2.35 PPWM2.MP 51.12,2.28 Q4.8
N$4  (1 unrouted)
  Top 0.61: Q4.5 Q4.6 | Q4.6 48.1,3.55 | 48.1,3.55 47.95,3.3 | 47.95,3.3 47.31,2.28 | Q4.5 47.95,3.3 | Q4.5 48.23,3.75 | 48.23,3.75 48.1,3.55 | Q4.6 48.23,3.75
  Top 0.75: Q4.5 47.31,2.28 PPWM3.MP 48.59,2.74 Q4.6
N$6  (1 unrouted)
  Top 0.61: 44.51,3.94 Q1.8 Q1.7 44.44,2.33 44.51,3.94 | 44.51,3.94 43.85,3.53
  Top 0.75: Q1.7 43.85,3.53 43.85,2.74 PPWM4.MP 45.12,2.28 Q1.8
N$7  (1 unrouted)
  Top 0.61: Q1.5 Q1.6 41.31,2.28 | Q1.5 42.59,2.74 | Q1.5 42.59,3.75
  Top 0.75: Q1.5 41.31,2.28 PPWM5.MP 42.59,2.74 42.59,3.75 Q1.6
N$8  (1 unrouted)
  Top 0.61: Q2.7 Q2.8 38.23,3.2 37.85,2.74 | Q2.7 39.12,2.7 | Q2.7 38.06,3 | 38.06,3 38.13,2.54 | PPWM6.MP 38.06,3
  Top 0.75: Q2.7 37.85,2.74 38.13,2.54 PPWM6.MP 39.12,2.28 39.12,2.7 Q2.8
N$9  (1 unrouted)
  Top 0.61: Q2.5 36.59,2.74 | Q2.5 Q2.6 35.66,3.2 | Q2.5 36.59,3.6 | 35.66,3.2 35.31,2.78 | PPWM7.MP 35.66,3.2
  Top 0.75: Q2.5 35.31,2.78 35.31,2.28 PPWM7.MP 36.59,2.74 36.59,3.6 Q2.6
N$11  (1 unrouted)
  Top 0.61: Q5.6 Q5.5 12.58,3.3 | Q5.6 11.64,3.73 | 11.64,3.73 11.31,3.53 | Q5.6 11.9,2.92 11.64,3.73
  Top 0.75: Q5.5 11.31,3.53 11.31,2.28 PPWM15.MP 12.58,2.74 12.58,3.3 Q5.6
N$12  (1 unrouted)
  Top 0.61: Q5.7 Q5.8 | Q5.8 13.86,3.6 | Q5.7 15.13,3.3 | Q5.8 13.86,2.74 | Q5.7 15.13,2.92
  Top 0.75: Q5.7 13.86,3.6 13.86,2.74 PPWM14.MP 15.13,2.28 15.13,2.92 15.13,3.3 Q5.8
N$13  (1 unrouted)
  Top 0.61: Q6.5 Q6.6 | Q6.6 17.31,3.75 | Q6.5 18.59,3.38 | Q6.6 17.31,3.08 | Q6.5 18.59,2.74 | Q6.6 17.31,2.55 | Q6.5 18,2.33
  Top 0.75: Q6.5 17.31,3.75 17.31,3.08 17.31,2.55 17.31,2.28 PPWM13.MP 18,2.33 18.59,2.74 18.59,3.38 Q6.6
N$14  (1 unrouted)
  Top 0.203: PPWM12.MP 20.46,2.39 20.35,2.39
  Top 0.61: Q6.8 Q6.7 21.12,3.08 | Q6.8 19.86,2.74 | Q6.8 20.3,2.42
  Top 0.75: Q6.7 19.86,2.74 PPWM12.MP 21.12,2.28 21.12,3.08 Q6.8
N$16  (1 unrouted)
  Top 0.61: Q7.5 Q7.6 24.22,3.73 | 24.22,3.73 23.98,3.36 | 23.98,3.36 23.31,2.28 | Q7.5 23.98,3.36 | Q7.5 24.22,3.73
  Top 0.75: Q7.5 23.31,2.28 PPWM11.MP 24.59,2.74 Q7.6
N$17  (1 unrouted)
  Top 0.61: Q7.8 Q7.7 27.12,3.3 | Q7.8 26.15,2.53 | Q7.8 25.85,3.15
  Top 0.75: Q7.7 25.85,3.15 25.85,2.74 26.15,2.53 PPWM10.MP 27.12,2.28 27.12,3.3 Q7.8
N$18  (1 unrouted)
  Top 0.61: 30.59,2.74 Q8.5 Q8.6 29.31,3
  Top 0.75: Q8.5 29.31,3 29.31,2.28 PPWM9.MP 30.59,2.74 Q8.6
N$19  (1 unrouted)
  Top 0.61: 33.12,2.85 Q8.7 Q8.8 31.85,2.74
  Top 0.75: Q8.7 31.85,2.74 PPWM8.MP 33.12,2.28 33.12,2.85 Q8.8
N$21
  Top 0.305: PI-ZERO.5 13.46,23.17 | 13.46,23.17 13.47,23.17 | 13.46,23.17 11.45,23.17 11.45,20.55 U1.26
N$22  (via drill 0.5)
  Top 0.203: U1.3 1.52,20.55 v1.32,20.85 | v22.74,20.9 22.74,20.75 SJ7.2
  Bottom 0.203: v22.74,20.9 20.87,20.9 18.54,23.23 5.74,23.23 5.51,23 5.51,22.78 3.25,22.78 v1.32,20.85
N$23  (via drill 0.5)
  Top 0.203: v26.07,20.75 SJ2.2 | v4.1,22.05 3.2,21.15 3.2,19.88 2.43,19.88 U1.4
  Bottom 0.203: v26.07,20.75 26.07,20.17 21.1,20.17 18.41,22.86 5.86,22.86 5.86,22.63 5.66,22.42 4.47,22.42 v4.1,22.05
N$24  (via drill 0.5)
  Top 0.203: v29.42,20.75 SJ1.2 | U1.5 1.65,19.25 v1.32,19.58
  Bottom 0.203: v29.42,20.75 28.48,19.81 20.95,19.81 18.29,22.48 6.22,22.48 5.8,22.07 5.11,22.07 4.27,21.22 2.22,21.22 2.22,20.47 v1.32,19.58
N$25
  Bottom 0.508: 63.59,9.88 63.59,7.12 60.47,7.12 63.59,10.25 63.59,9.88 | 63.59,9.88 61.22,7.5 | 60.97,7.25 61.22,7.5 | 61.22,7.5 63.22,7.5 63.34,7.62 63.34,9.12 | 63.34,9.38 63.34,9.12 | 63.34,9.12 62.09,7.88 | 61.97,7.75 62.09,7.88 | 62.09,7.88 63.09,7.88 63.09,8.5 62.72,8.12 62.72,8
N$26
  Top 0.305: U1.27 10.92,21.2 PI-ZERO.3
N$27  (via drill 0.5)
  Top 0.203: v19.45,23.38 19.45,20.75 SJ3.2 | U1.2 2.04,21.2 1.32,21.92 v1.32,22.35
  Bottom 0.203: v19.45,23.38 18.9,23.38 18.69,23.59 5.59,23.59 5.14,23.13 3.1,23.13 2.32,22.35 v1.32,22.35
N$28
  Top 0.508: 58.47,11.25 58.47,9.5 60.97,12 60.97,13.25 60.47,13.75 | 60.09,14.12 60.47,13.75 | 60.47,13.75 60.47,11.75
OE
  Top 0.203: U1.23 6.67,18.6 5.93,17.86 5.93,14.34 7.02,13.25 7.02,11.08 7.02,10.88 7.02,10.12 5.45,8.55 4.47,8.55 R7.1 | 4.62,8.67 4.62,8.5
  Top 0.305: 4.92,8.5 4.62,8.5 R7.1
PLUS
  Top 0.508: 59.72,7.25 63.34,10.88 | 63.34,10.88 63.34,7.25 | 63.34,7.25 59.72,7.25 | 59.72,7.25 59.59,7.12 60.09,7.12 | 63.34,7.25 63.22,7.12 | 63.22,7.12 60.09,7.12 | 60.09,7.12 62.97,10 | 63.09,10.12 62.97,10 | 62.97,10 62.97,7.62 60.97,7.62 62.47,9.12 62.72,9.12 62.72,8.12 62.47,7.88 | 62.47,7.88 62.34,8 | 62.34,8 61.72,8 62.22,8.5 62.47,8.5 62.47,8.12 62.34,8 | 62.47,7.88 63.22,7.12 | 63.22,7.12 63.59,7.12 63.59,11.12 63.34,10.88
VCC
  Top 0.305: U1.28 8.38,21.85 | SJ3.1 SJ7.1 SJ2.1 | SJ2.1 SJ1.1 | 4.47,11.52 C1.1 | PI-ZERO.17 27.74,25.21 SJ2.1
  Top 0.508: PI-ZERO.1 8.38,21.85 | U1.28 6.85,21.85 | 6.82,21.85 6.85,21.85 | 6.85,21.85 4.47,19.48 4.47,11.52
  Bottom 0.203: PI-ZERO.1 9.3,25.21 10.44,26.35 26.63,26.35 27.77,25.21 PI-ZERO.17
(copper drawn outside any net)
  shapes: Top area x1

### Text on the board
tPlace: 7 | 6 | 5 | 4 | 3 | 2 | 1 | 0 | A1 | A2 | A3 | A4 | 15 | 14 | 11 | 10 | 9 | 8 | 13 | 12 | PCA9685 | 10uF | 10K | Dra | 15 | 14 | 13 | 12 | 11 | 10 | 9 | 8 | 7 | 6 | 5 | 4 | 3 | 2 | 1 | 0